# Altium schematic sheet DisplayUnit.SchDoc
size A4; SheetNumber: 4; SheetTotal: 4
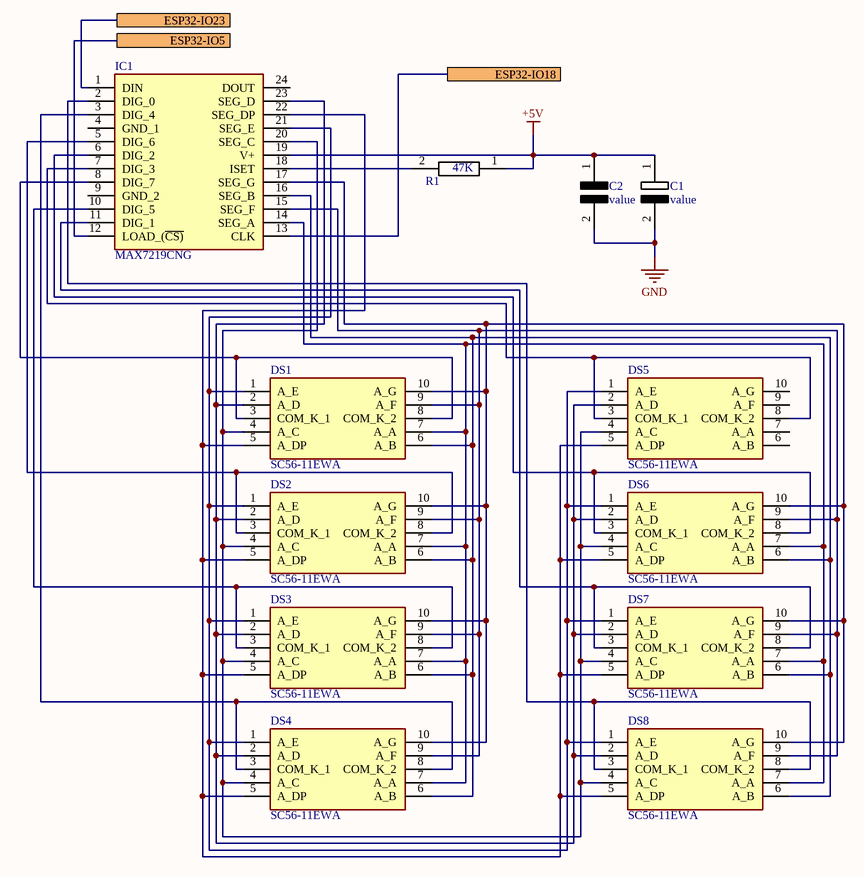
[diagram p0: DisplayUnit.SchDoc]

## Parts
C1  value  [C0805]
C2  value  [C0805]
DS1  SC56-11EWA  [DIPS1524W75P254L1270H825Q10N]
DS2  SC56-11EWA  [DIPS1524W75P254L1270H825Q10N]
DS3  SC56-11EWA  [DIPS1524W75P254L1270H825Q10N]
DS4  SC56-11EWA  [DIPS1524W75P254L1270H825Q10N]
DS5  SC56-11EWA  [DIPS1524W75P254L1270H825Q10N]
DS6  SC56-11EWA  [DIPS1524W75P254L1270H825Q10N]
DS7  SC56-11EWA  [DIPS1524W75P254L1270H825Q10N]
DS8  SC56-11EWA  [DIPS1524W75P254L1270H825Q10N]
IC1  MAX7219CNG  [DIP794W56P254L3054H457Q24N]
R1  47K  [RESC2012X60N]

## Ports
ESP32-IO5, ESP32-IO18, ESP32-IO23

## Nets
+5V: C1.1 C2.1 IC1.19(V+) R1.1
GND: C1.2 C2.2
ESP32-IO5: IC1.12(LOAD_(~{CS)}) ; port ESP32-IO5
ESP32-IO18: IC1.13(CLK) ; port ESP32-IO18
ESP32-IO23: IC1.1(DIN) ; port ESP32-IO23
NetDS1_1: DS1.1(A_E) DS2.1(A_E) DS3.1(A_E) DS4.1(A_E) DS5.1(A_E) DS6.1(A_E) DS7.1(A_E) DS8.1(A_E) IC1.21(SEG_E)
NetDS1_2: DS1.2(A_D) DS2.2(A_D) DS3.2(A_D) DS4.2(A_D) DS5.2(A_D) DS6.2(A_D) DS7.2(A_D) DS8.2(A_D) IC1.23(SEG_D)
NetDS1_3: DS1.3(COM_K_1) DS1.8(COM_K_2) IC1.8(DIG_7)
NetDS1_4: DS1.4(A_C) DS2.4(A_C) DS3.4(A_C) DS4.4(A_C) DS5.4(A_C) DS6.4(A_C) DS7.4(A_C) DS8.4(A_C) IC1.20(SEG_C)
NetDS1_5: DS1.5(A_DP) DS2.5(A_DP) DS3.5(A_DP) DS4.5(A_DP) DS5.5(A_DP) DS6.5(A_DP) DS7.5(A_DP) DS8.5(A_DP) IC1.22(SEG_DP)
NetDS1_6: DS1.6(A_B) DS2.6(A_B) DS3.6(A_B) DS4.6(A_B) DS6.6(A_B) DS7.6(A_B) DS8.6(A_B) IC1.16(SEG_B)
NetDS1_7: DS1.7(A_A) DS2.7(A_A) DS3.7(A_A) DS4.7(A_A) DS6.7(A_A) DS7.7(A_A) DS8.7(A_A) IC1.14(SEG_A)
NetDS1_9: DS1.9(A_F) DS2.9(A_F) DS3.9(A_F) DS4.9(A_F) DS6.9(A_F) DS7.9(A_F) DS8.9(A_F) IC1.15(SEG_F)
NetDS1_10: DS1.10(A_G) DS2.10(A_G) DS3.10(A_G) DS4.10(A_G) DS6.10(A_G) DS7.10(A_G) DS8.10(A_G) IC1.17(SEG_G)
NetDS2_3: DS2.3(COM_K_1) DS2.8(COM_K_2) IC1.5(DIG_6)
NetDS3_3: DS3.3(COM_K_1) DS3.8(COM_K_2) IC1.10(DIG_5)
NetDS4_3: DS4.3(COM_K_1) DS4.8(COM_K_2) IC1.3(DIG_4)
NetDS5_3: DS5.3(COM_K_1) DS5.8(COM_K_2) IC1.7(DIG_3)
NetDS6_3: DS6.3(COM_K_1) DS6.8(COM_K_2) IC1.6(DIG_2)
NetDS7_3: DS7.3(COM_K_1) DS7.8(COM_K_2) IC1.11(DIG_1)
NetDS8_3: DS8.3(COM_K_1) DS8.8(COM_K_2) IC1.2(DIG_0)
NetIC1_18: IC1.18(ISET) R1.2

Not connected (* = marked no-connect by the designer): DS5 6(A_B) 7(A_A) 9(A_F) 10(A_G); IC1 4(GND_1) 9(GND_2) 24(DOUT)

## Library data of the parts
C1 = elektrolytischeC0805: 0805 ceramic capacitor; Manufacturer_Name: Murata Electronics; Manufacturer_Part_Number: GRM188R71H103KA01D; Datasheet Link: https://datasheet.datasheetarchive.com/originals/distributors/Datasheets_SAMA/ec4f1577dddcc7a13ddad897a28002d3.pdf; Height: 0.9mm; Mouser Part Number: 81-GRM39X103K50D; Mouser Price/Stock: https://www.mouser.co.uk/ProductDetail/Murata-Electronics/GRM188R71H103KA01D?qs=WWniysbtxULrL2ljbViAbw%3D%3D; Arrow Part Number: GRM188R71H103KA01D; Arrow Price/Stock: https://www.arrow.com/en/products/grm188r71h103ka01d/murata-manufacturing?region=europe
C2 = KeramischeC0805_1: 0805 ceramic capacitor; Manufacturer_Name: Murata Electronics; Manufacturer_Part_Number: GRM188R71H103KA01D; Datasheet Link: https://datasheet.datasheetarchive.com/originals/distributors/Datasheets_SAMA/ec4f1577dddcc7a13ddad897a28002d3.pdf; Height: 0.9mm; Mouser Part Number: 81-GRM39X103K50D; Mouser Price/Stock: https://www.mouser.co.uk/ProductDetail/Murata-Electronics/GRM188R71H103KA01D?qs=WWniysbtxULrL2ljbViAbw%3D%3D; Arrow Part Number: GRM188R71H103KA01D; Arrow Price/Stock: https://www.arrow.com/en/products/grm188r71h103ka01d/murata-manufacturing?region=europe
DS1-DS8 = SC56-11EWA: Display; Manufacturer_Name: Kingbright; Datasheet Link: https://www.kingbrightusa.com/images/catalog/SPEC/SC56-11EWA.pdf; Height: 8.25mm; Manufacturer_Part_Number: SC56-11EWA; Mouser Part Number: 604-SC56-11EWA; Mouser Price/Stock: https://www.mouser.co.uk/ProductDetail/Kingbright/SC56-11EWA?qs=y3UkhjaxUTZA9319us7IBQ%3D%3D
IC1 = MAX7219CNG: Integrated Circuit; Manufacturer_Name: Analog Devices; Datasheet Link: https://datasheets.maximintegrated.com/en/ds/MAX7219-MAX7221.pdf; Height: 4.572mm; Manufacturer_Part_Number: MAX7219CNG; Mouser Part Number: 700-MAX7219CNG-NR; Mouser Price/Stock: https://www.mouser.co.uk/ProductDetail/Maxim-Integrated/MAX7219CNG?qs=p6VZ%252BklCkRToQRlZGegBBA%3D%3D
R1 = Resistor0805: Manufacturer_Name: Vishay; Manufacturer_Part_Number: CRCW08050000Z0EAHP; Datasheet Link: https://componentsearchengine.com/Datasheets/1/CRCW08051R00FKEAHP.pdf; Height: 0.6mm; Mouser Part Number: 71-CRCW08050000Z0EAH; Mouser Price/Stock: https://www.mouser.co.uk/ProductDetail/Vishay-Dale/CRCW08050000Z0EAHP?qs=pTGEtN%252BMLlDLrJUqQmN2jA%3D%3D; Arrow Part Number: CRCW08050000Z0EAHP; Arrow Price/Stock: https://www.arrow.com/en/products/crcw08050000z0eahp/vishay?region=nac